# EAGLE design PowerDongle (EAGLE 7.6.0)
COMPANY: ADAFRUIT INDUSTRIES; DRAWN: KTOWN; REV: A; YEAR: 2019
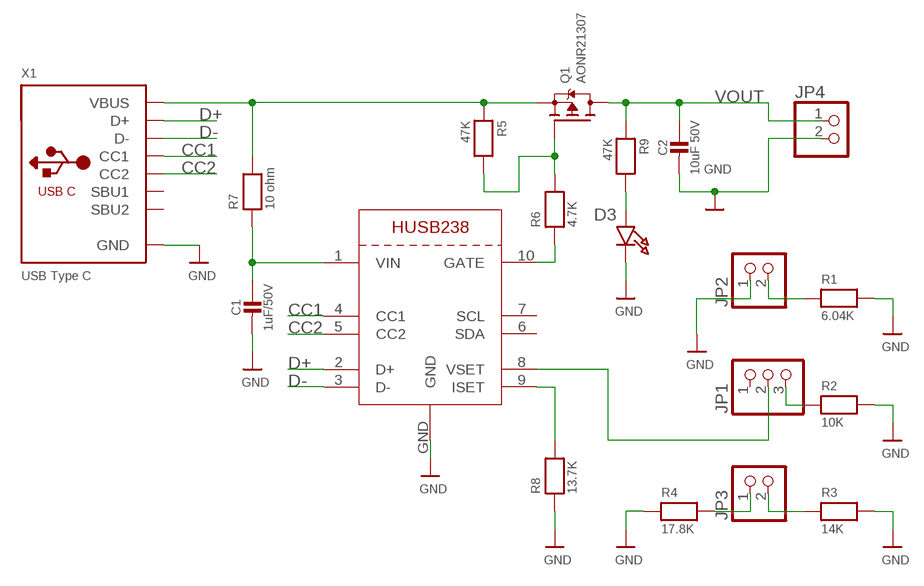
[diagram p0: schematic, sheet 1]

## Parts
C1  1uF/50V  CAP_CERAMIC_0805MP  [_0805MP]
C2  10uF 50V  CAP_CERAMIC_0805MP  [_0805MP]
D3  Green  LED0805_NOOUTLINE  [CHIPLED_0805_NOOUTLINE]
JP1  HEADER-1X3ROUND  [1X03_ROUND]
JP2  HEADER-1X2ROUND  [1X02_ROUND]
JP3  HEADER-1X2ROUND  [1X02_ROUND]
JP4  HEADER-1X2ROUND  [1X02_ROUND]
Q1  AONR21307  MOSFET-P-POWERDI3333  [POWERDI3333]
R1  6.04K  RESISTOR_0805MP  [_0805MP]
R2  10K  RESISTOR_0805MP  [_0805MP]
R3  14K  RESISTOR_0805MP  [_0805MP]
R4  17.8K  RESISTOR_0805MP  [_0805MP]
R5  47K  RESISTOR_0805MP  [_0805MP]
R6  4.7K  RESISTOR_0805MP  [_0805MP]
R7  10 ohm  RESISTOR_0805MP  [_0805MP]
R8  13.7K  RESISTOR_0805MP  [_0805MP]
R9  47K  RESISTOR_0805MP  [_0805MP]
X1  USB Type C  USB_C  [USB_C_CUSB31-CFM2AX-01-X]
X3  HUSB238  [DFN10_3X3MM]

## Nets
CC1: X1.A5(CC1) X3.4(CC1)
CC2: X1.B5(CC2) X3.5(CC2)
D+: X1.A6(D+) X1.B6(D+) X3.2(D+)
D-: X1.A7(D-) X1.B7(D-) X3.3(D-)
GND: C1.2 C2.2 D3.C JP2.1 JP4.2 R1.2 R2.2 R3.2 R4.1 R8.1 X1.A1B12(GND) X1.B1A12(GND) X3.GND
N$1: C1.1 R7.1 X3.1(VIN)
N$2: Q1.4(G) R5.2 R6.2
N$3: D3.A R9.2
N$4: R6.1 X3.10(GATE)
N$5: R8.2 X3.9(ISET)
N$6: JP2.2 R1.1
N$7: JP1.3 R2.1
N$8: JP1.2 X3.8(VSET)
N$9: JP3.2 R3.1
N$10: JP3.1 R4.2
VBUS: Q1.1(S) Q1.2(S) Q1.3(S) R5.1 R7.2 X1.A4B9(VBUS) X1.B4A9(VBUS)
VOUT: C2.1 JP4.1 Q1.5678(D) R9.1
Unconnected: JP1.1 X1.A8(SBU1) X1.B8(SBU2) X3.6(SDA) X3.7(SCL)

## Library data of the parts
C1 C2 = microbuilder:CAP_CERAMIC: Ceramic Capacitors 0402 - 0402 Surface Mount Capacitors 16pF 50V 5% [Digikey: 445-4899-2-ND] 18pF 50V 5% [Digikey: 490-1281-2-ND] 22pF 50V 5% [Digikey: 490-1283-2-ND] 68pF 50V 5% [Digikey: 490-1289-2-ND] 0.1uF 10V 10% [Digikey: 490-1318-2-ND] 1.0uF 6.3V 10% [Digikey: 490-1320-2-ND] 0603 - 0603 Surface Mount Capacitors 16 pF 50V 5% [Digikey: 445-5051-2-ND] 22 pF 50V [Digikey: PCC220ACVTR-ND] 33 pF 50V 5% [Digikey: 490-1415-1-ND] 56pF 50V 5% [Digikey: 490-1421-1-ND] 220pF 50V 5% [Digikey: 445-1285-1-ND] 680 pF 50V 2200 pF 50V 5% C0G [Digikey: 445-1297-1-ND] 5600 pF 100V 5% X7R [Digikey: 478-3711-1-ND] 0.1 µF 25V 10% [Digikey: PCC2277TR-ND] 0.22 µF 16V 10% X7R [Digikey: 445-1318-1-ND] 1.0 µF 25V 10% [Digikey: 445-5146-2-ND] 0603 - RF Specific 3pF 250V +/-0.1pF RF [Digikey: 712-1347-1-ND] 18 pF 250V 5% [Digikey: 478-3505-1-ND or 712-1322-1-ND] 56 pF 250V 5% C0G RF [Digikey: 490-4867-1-ND] 68 pF 250V RF [Digikey: 490-4868-1-ND] 0805 - 0805 Surface Mount Capacitors 220 pF 250V 2% RF Ceramic Capacitor [Digikey: 712-1398-1-ND] 1000 pF 50V 2% NP0 Ceramic Capacitor [Digikey: 478-3760-1-ND] 0.1 µF 25V 10% Ceramic Capacitor [Digikey: PCC1828TR-ND] 1.0 µF 16V 10% Ceramic Capacitor[Digikey: 490-1691-2-ND] 10.0 µF 10V 10% Ceramic Capacitor[Digikey: 709-1228-1-ND] 10.0 uF 16V 10% Ceramic Capacitor [Digikey: 478-5165-2-ND] 47 uF 6.3V 20% Ceramic Capacitor [Digikey: 587-1779-1-ND or 399-5506-1-ND] 1206 - 1206 Surface Mount Capacitors 47uF 10V 20% Ceramic Capacitor [Digikey: 490-5528-1-ND or 399-5508-1-ND or 445-6010-1-ND] 100uF 6.3V -20%, +80% Y5V Ceramic Capacitor (Digikey: 490-4512-1-ND, Mouser: 81-GRM31CF50J107ZE1L)
D3 = microbuilder:LED: LED 0603 - 0603 Surface Mount Package 2mA: Green LED - Low Power (3.9mcd, 2ma, 1.7Vf) - Digikey: 475-2709-2-ND Orange LED - Low Power (9.8mcd, 2ma, 1.8Vf) - Digikey: 475-1194-2-ND Red LED - Low Power (5mcd, 2ma, 1.8Vf) - Digikey: 475-1195-2-ND Yellow LED - Low Power (7mcd, 2ma, 1.8Vf) - Digikey: 475-1196-2-ND 5mA: Blue LED - Low Power (17mcd, 5ma, 2.9Vf) - Digikey: LNJ937W8CRACT-ND 0805 - 0805 Surface Mount Package 2mA: Red LED (8.8mcd, 2mA, 1.8Vf, Clear) - Low Power [Digikey: 475-2510-1-ND] Green LED (5mcd, 2mA, 1.8Vf, Clear) - Low Power [Digikey: 475-2730-1-ND] Yellow LED (11.3mcd, 2mA, 1.8Vf, Clear) - Low Power [Digikey: 475-2555-1-ND] 20mA: Red LED (104mcd, 20mA, Diffused) - LS R976 [Digikey: 475-1278-6-ND] Red LED (12mcd, 20mA, 2.0Vf, Clear) - APT2012EC [Digikey: 754-1128-1-ND] Green LED (15mcd, 20mA, 2.2Vf, Clear) - APT2012GC [Digikey: 754-1131-1-ND] Orange LED (160mcd, 20mA, 2.1Vf, Clear) - APT2012SECK [Digikey: 754-1130-1-ND] 1206 - 1206 Surface Mount Package Green LED (26mcd, 20mA, Diffused) - LG N971 [Digikey: 475-1407-6-ND] Red LED (15mcd, 20mA, Diffused) - LH N974 [Digikey: 475-1416-6-ND]
JP1 = microbuilder:HEADER-1X3: PIN HEADER
JP2-JP4 = microbuilder:HEADER-1X2: PIN HEADER
Q1 = microbuilder:MOSFET-P: P-Channel Mosfet LEGEND VDS: Voltage Drain-Source ID: Drain Current RDS(ON): Drain-Source On-State Resistance VGS(TH): Gate-Source Threshold Voltage CISS: Drain-Source Input Capacitance SOT-23 Name VDS ID RDS(ON) VGS(TH) CISS Order Number IRLML5103 30V 760mA 600 mOhm -- 75pF @ 25V Digikey: IRLML5103PBFCT-ND IRLML6401 12V 4.3A 50 mOhm 950mV @ 250µA 830pF @ 10V Digikey: IRLML6401PBFTR-ND NTR0202PL 20V 400mA 800 mOhm 2.3V @ 250uA 70pF @ 5V Digikey: NTR0202PLT1GOSTR-ND NTR4101PT1G 20V 1.8A 85 mOhm 1.2V @ 250uA 675pF @ 10V Digikey: NTR4101PT1GOSCT-ND DMP2004K 20V 600mA 900 mOhm 1V @ 250uA 175pF @ 16V Digikey: DMP2004KDICT-ND PMV65XP 20V 3.9A 76 mOhm 950mV @ 1mA 725pF @ 20V Digikey: 568-2358-2-ND TO-252 Name VDS ID RDS(ON) VGS(TH) CISS Order Number AOD417 30V 25A 34 mOhm 3V @ 250µA 920pF @ 15V Digikey: 785-1106-2-ND PowerPak Name VDS ID RDS(ON) VGS(TH) CISS Order Number AON7401 30V 12A 14 mOhm 3V @ 250µA 2600pF @ 15V Digikey: 785-1302-1-ND; ROT: 270
R1-R9 = microbuilder:RESISTOR: Resistors 0402 - 0402 Surface Mount Package 22 Ohm 1% 1/16W [Digikey: 311-22.0LRTR-ND] 33 Ohm 5% 1/16W 1.0K 5% 1/16W 1.5K 5% 1/16W 2.0K 1% 1/16W 10.0K 1% 1/16W [Digikey: 311-10.0KLRTR-ND] 10.0K 5% 1/16W [Digikey: RMCF0402JT10K0TR-ND] 12.1K 1% 1/16W [Digikey: 311-22.0LRTR-ND] 100.0K 5% 1/16W 0603 - 0603 Surface Mount Package 0 Ohm 1/10 Watt 1% Resistor 15 Ohm 1/10 Watt 1% Resistor 33 Ohm 1/10 Watt 1% Resistor 49.9 Ohm 1/10 Watt 1% Resistor 100 Ohm 1/10 Watt 1% Resistor 150 Ohm 1/10 Watt 1% Resistor 240 Ohm 1/10 Watt 1% Resistor 390 Ohm 1/10 Watt 1% Resistor 560 Ohm 1/10 Watt 1% Resistor 680 Ohm 1/10 Watt 1% Resistor 750 Ohm 1/10 Watt 1% Resistor 1.0K Ohm 1/10 Watt 1% Resistor 1.5K Ohm 1/10 Watt 1% Resistor 2.0K Ohm 1/10 Watt 1% Resistor 2.2K Ohm 1/10 Watt 1% Resistor 3.3K Ohm 1/10 Watt 1% Resistor 4.7K Ohm 1/10 Watt 1% Resistor 10.0K Ohm 1/10 Watt 1% Resistor 12.0K Ohm 1/10 Watt 1% Resistor 12.1K Ohm 1/10 Watt 1% Resistor 20.0K Ohm 1/10 Watt 1% Resistor 33.0K Ohm 1/10 Watt 1% Resistor 100.0K Ohm 1/10 Watt 1% Resistor 0805 - 0805 Surface Mount Package 0 Ohm 1/8 Watt 1% Resistor 33 Ohm 1/8 Watt 1% Resistor 100 Ohm 1/8 Watt 1% Resistor 150 Ohm 1/8 Watt 1% Resistor 200 Ohm 1/8 Watt 1% Resistor 240 Ohm 1/8 Watt 1% Resistor 330 Ohm 1/8 Watt 1% Resistor 390 Ohm 1/8 Watt 1% Resistor 470 Ohm 1/8 Watt 1% Resistor 1.0K Ohm 1/8 Watt 1% Resistor 1.5K Ohm 1/8 Watt 1% Resistor 2.0K Ohm 1/8 Watt 1% Resistor 4.7K Ohm 1/8 Watt 1% Resistor 5.1K Ohm 1/8 Watt 1% Resistor 5.6K Ohm 1/8 Watt 1% Resistor 10.0K Ohm 1/8 Watt 1% Resistor 22.0K Ohm 1/8 Watt 1% Resistor 33.0K Ohm 1/8 Watt 1% Resistor 100K Ohm 1/8 Watt 1% Resistor 1206 - 1206 Surface Mount Package 2012 - 2010 Surface Mount Package 0.11 Ohm 1/2 Watt 1% Resistor - Digikey: RHM.11UCT-ND
X1 = adafruit_electromech:USB_C: USB Type-C USB 2.0 Connector; LCSC: C165948
X3 = adafruit_power:HUSB238

## Board
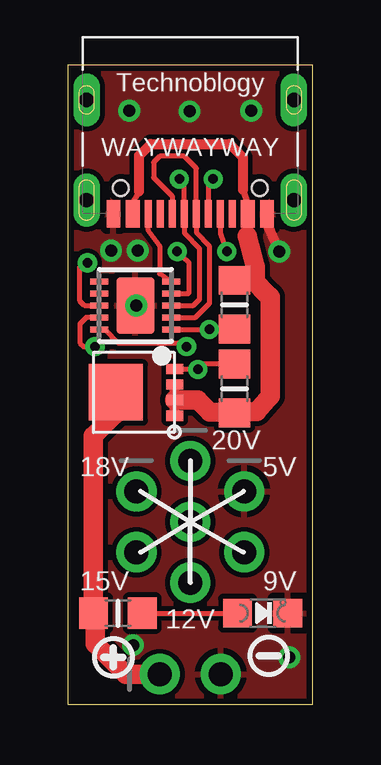
[diagram p1: board, top side]
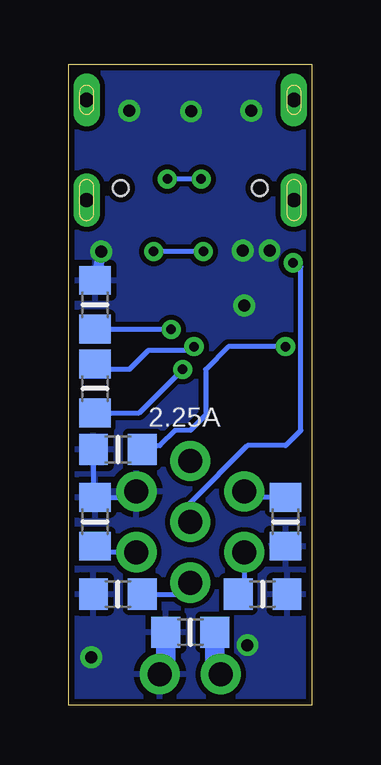
[diagram p2: board, bottom side, seen from below]

Size 10.16 x 26.67 mm. Coordinates in mm from the lower left corner, seen from the top.
Outline: 0,26.67 10.16,26.67 10.16,0 0,0 0,26.67
Copper layers (1*16): Top 0.035mm / dielectric 1.5mm / Bottom 0.035mm
Design rules "adafruit": minimum track width 8mil, minimum drill 15.5mil, track to track 8mil, track to pad 8mil, pad to pad 8mil, via to via 8mil, smd to smd 8mil, copper to edge 10mil, drill to drill 8mil, minimum pad ring 10mil, minimum via ring 8mil, stop-mask expansion 2mil, vias tented up to drill 20mil, thermal gap 10mil

### Footprints (pad centres in the part's own frame; a part is rotated, then mirrored left to right if it is on the bottom)
_0805MP = smd 1.2 x 1.3: 1 -1.016,0; 2 1.016,0
CHIPLED_0805_NOOUTLINE = smd 1.2 x 1.2: A 0,-1.05; C 0,1.05
1X03_ROUND = drill 1 pad 1.676: 1 -2.54,0; 2 0,0; 3 2.54,0
1X02_ROUND = drill 1 pad 1.676: 1 -1.27,0; 2 1.27,0
POWERDI3333 = smd 0.7 x 0.42: 1 -1.446,0.975; 2 -1.446,0.325; 3 -1.446,-0.325; 4 -1.446,-0.975 | smd 2.25 x 2.35: 5678 1.004,0
USB_C_CUSB31-CFM2AX-01-X = smd 0.575 x 1.15: A1B12 -3.2,2.275; A4B9 -2.4,2.275; B1A12 3.2,2.275; B4A9 2.4,2.275 | smd 0.275 x 1.15: A5 -1.25,2.275; A6 -0.25,2.275; A7 0.25,2.275; A8 1.25,2.275; B5 1.75,2.275; B6 0.75,2.275; B7 -0.75,2.275; B8 -1.75,2.275 | drill 0.6 pad 1 long: M1 -4.32,1.7; M2 4.32,1.7; M3 -4.32,-2.48; M4 4.32,-2.48 | hole 0.65: 2.89,1.2; -2.89,1.2
DFN10_3X3MM = smd 0.25 x 0.8: 1 -1,-1.5; 2 -0.5,-1.5; 3 0,-1.5; 4 0.5,-1.5; 5 1,-1.5; 6 1,1.5; 7 0.5,1.5; 8 0,1.5; 9 -0.5,1.5; 10 -1,1.5 | smd 2.35 x 1.58: GND 0,0

### Placement (x,y rotation side)
C1  9.05,16.67 90 bottom
C2  5.08,3.02 180 bottom
D3  8.1,3.81 270 top
JP1  5.08,7.62 270 top
JP2  7.33,7.62 270 top
JP3  2.83,7.62 270 top
JP4  5.08,1.27 0 top
Q1  2.98,13.02 180 top
R1  9.05,7.62 90 bottom
R2  8.1,4.6 180 bottom
R3  2.06,4.6 0 bottom
R4  1.11,7.62 90 bottom
R5  6.92,13.18 90 top
R6  9.05,13.18 270 bottom
R7  6.92,16.67 90 top
R8  8.1,10.64 0 bottom
R9  2.06,3.81 0 top
U$7  [SYMBOL_PLUS]  1.87,1.97 0 top
U$14  [SYMBOL_MINUS]  8.35,2.03 0 top
X1  5.08,22.73 180 top
X3  2.79,16.64 90 top

### Tracks (layer width: path | path; a pad name or v marks a point on that pad's centre or on a via)
CC1  (via drill 0.39)
  Top 0.203: v4.54,18.89 5.01,18.45 5.01,17.14 X3.4 | X1.A5 6.33,19.65 v6.6,18.89
  Bottom 0.203: v4.54,18.89 v6.6,18.89
CC2
  Top 0.203: X3.5 3.81,17.97 3.81,19.12 3.33,19.76 X1.B5
D+
  Top 0.203: X1.B6 4.33,21.2 3.56,21.97 3.56,22.61 3.81,22.86 4.83,22.86 5.33,22.36 X1.A6 5.33,19.68 5.87,19.11 5.87,16.72 5.29,16.14 X3.2
D-  (via drill 0.39)
  Top 0.203: v4.62,21.91 4.83,21.77 X1.A7 4.83,19.66 5.46,19.02 5.46,16.89 5.21,16.64 X3.3 | X1.B7 5.83,21.73 v6.04,21.91
  Bottom 0.203: v4.62,21.91 v6.04,21.91
GND  (via drill 0.5)
  Top 0.406: X1.A1B12 8.31,19.95 v8.79,18.88
  Bottom 0.203: JP2.1 7.58,8.64 R1.2 9.11,8.7 R8.1
  Bottom 0.406: v8.79,18.88 C1.2
  Bottom 0.813: C2.2 6.1,1.52 JP4.2
  other vias: 2.89,18.92 2.83,16.64 5.05,24.73 2.7,2.48 9.21,1.97 1.78,18.92 2.54,24.77 7.62,24.77
  pour Top: 0,26.67 10.16,26.67 10.16,0 0,0
  pour Bottom: 0,26.67 10.16,26.67 10.16,0 0,0
N$1  (via drill 0.39)
  Top 0.203: X3.1 v5.87,15.64 6.81,15.64 R7.1
  Bottom 0.203: C1.1 5.73,15.65 v5.87,15.64
N$2  (via drill 0.39)
  Top 0.203: Q1.4 4.43,13.97 v5.4,13.97 5.62,14.19 R5.2
  Bottom 0.203: R6.2 7.21,12.16 v5.4,13.97
N$3
  Top 0.203: R9.2 D3.A
N$4  (via drill 0.39)
  Top 0.203: X3.10 1.51,15.64 2.06,15.08 4.6,15.08 v4.92,14.92
  Bottom 0.203: v4.92,14.92 5.08,14.76 6.83,14.76 7.62,13.97 8.73,13.97 R6.1
N$5  (via drill 0.39)
  Top 0.203: X3.9 0.74,16.14 0.48,15.88 0.48,15.08 0.63,14.92 v1.11,14.92
  Bottom 0.203: v1.11,14.92 3.49,14.92 4.45,13.97 4.45,12.07 5.08,11.43 5.71,11.43 6.35,10.79 R8.2
N$6
  Bottom 0.203: JP2.2 8.79,6.35 R1.1
N$7
  Bottom 0.203: R2.1 5.56,4.6 JP1.3
N$8  (via drill 0.39)
  Top 0.203: v0.79,18.41 0.48,18.26 0.48,16.83 0.67,16.64 X3.8
  Bottom 0.203: JP1.2 5.08,8.41 2.7,10.79 1.11,10.79 0.48,11.43 0.48,18.26 v0.79,18.41
N$9
  Bottom 0.203: JP3.2 2.83,4.85 R3.1
N$10
  Bottom 0.203: R4.2 2.58,8.64 JP3.1
VBUS
  Top 0.254: X1.B4A9 2.78,20.36 2.79,20.19 2.63,20.82 2.95,21.4 | 7.27,21.46 7.51,20.8 7.62,20.69 7.46,20.96 X1.A4B9
  Top 0.406: 2.95,21.4 2.95,22.89 3.43,23.37 6.72,23.37 7.27,22.82 7.27,21.46 | X1.A4B9 7.48,19.54 7.46,19.53 | Q1.1 Q1.2 Q1.3
  Top 0.813: Q1.2 5.39,12.69 5.89,12.19 R5.1 7.84,12.22 8.41,12.86 8.41,16.99 8.26,17.14 7.78,17.62 | 7.46,19.53 7.78,18.26 7.78,17.62 | R7.2 7.71,17.68 7.78,17.62
VOUT
  Top 0.813: JP4.1 2.38,1.27 1.11,2.54 1.11,3.75 R9.1 1.05,11.21 1.91,12.07 1.91,12.94 Q1.5678
  Bottom 0.813: C2.1 4.06,1.52 JP4.1

### Text on the board
tNames: Technoblogy | WAYWAYWAY | 20V | 18V | 5V | 15V | 9V | 12V
bNames: 2.25A